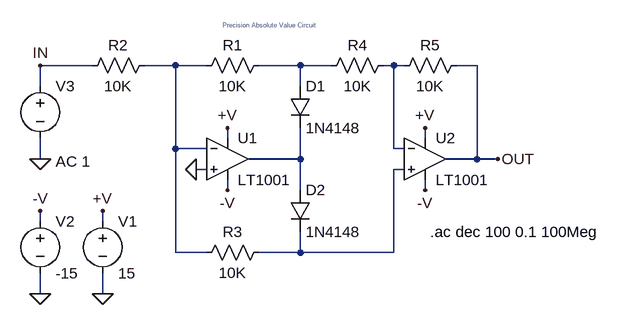
[diagram p0: schematic Fig_3-7_LT1001_AC.asc]
Fig_3-7_LT1001_AC.asc, the LTspice schematic file:
Version 4
SHEET 1 896 680
WIRE -16 96 -96 96
WIRE 112 96 64 96
WIRE 160 96 112 96
WIRE 304 96 240 96
WIRE 352 96 304 96
WIRE 448 96 432 96
WIRE 464 96 448 96
WIRE 576 96 544 96
WIRE -96 128 -96 96
WIRE 304 128 304 96
WIRE 192 208 192 192
WIRE 496 208 496 192
WIRE 112 224 112 96
WIRE 160 224 112 224
WIRE 448 224 448 96
WIRE 464 224 448 224
WIRE -96 240 -96 208
WIRE 304 240 304 192
WIRE 304 240 224 240
WIRE 576 240 576 96
WIRE 576 240 528 240
WIRE 608 240 576 240
WIRE 160 256 144 256
WIRE 464 256 448 256
WIRE 192 288 192 272
WIRE 304 288 304 240
WIRE 496 288 496 272
WIRE -96 336 -96 320
WIRE 0 336 0 320
WIRE 112 384 112 224
WIRE 160 384 112 384
WIRE 304 384 304 352
WIRE 304 384 240 384
WIRE 448 384 448 256
WIRE 448 384 304 384
WIRE -96 448 -96 416
WIRE 0 448 0 416
FLAG 0 448 0
FLAG 192 192 +V
FLAG 0 320 +V
FLAG 192 288 -V
FLAG -96 448 0
FLAG -96 320 -V
FLAG -96 240 0
FLAG 496 192 +V
FLAG 496 288 -V
FLAG 144 256 0
FLAG -96 96 IN
FLAG 608 240 OUT
SYMBOL voltage 0 320 R0
SYMATTR InstName V1
SYMATTR Value 15
SYMBOL opamps\\LT1001 192 176 R0
SYMATTR InstName U1
SYMBOL voltage -96 320 R0
SYMATTR InstName V2
SYMATTR Value -15
SYMBOL res 256 80 R90
WINDOW 0 0 56 VBottom 2
WINDOW 3 32 56 VTop 2
SYMATTR InstName R1
SYMATTR Value 10K
SYMBOL voltage -96 112 R0
WINDOW 123 24 132 Left 2
WINDOW 39 0 0 Left 2
SYMATTR Value2 AC 1
SYMATTR InstName V3
SYMATTR Value ""
SYMBOL opamps\\LT1001 496 176 R0
SYMATTR InstName U2
SYMBOL diode 288 128 R0
SYMATTR InstName D1
SYMATTR Value 1N4148
SYMBOL res 80 80 R90
WINDOW 0 0 56 VBottom 2
WINDOW 3 32 56 VTop 2
SYMATTR InstName R2
SYMATTR Value 10K
SYMBOL res 256 368 R90
WINDOW 0 0 56 VBottom 2
WINDOW 3 32 56 VTop 2
SYMATTR InstName R3
SYMATTR Value 10K
SYMBOL res 448 80 R90
WINDOW 0 0 56 VBottom 2
WINDOW 3 32 56 VTop 2
SYMATTR InstName R4
SYMATTR Value 10K
SYMBOL res 560 80 R90
WINDOW 0 0 56 VBottom 2
WINDOW 3 32 56 VTop 2
SYMATTR InstName R5
SYMATTR Value 10K
SYMBOL diode 288 288 R0
SYMATTR InstName D2
SYMATTR Value 1N4148
TEXT 504 352 Left 2 !.ac dec 100 0.1 100Meg
TEXT 256 40 Bottom 0 ;Precision Absolute Value Circuit

The netlist it stands for:
* Fig_3-7_LT1001_AC.asc
V1 +V 0 15
XU1 0 N001 +V -V N004 LT1001  ; pins In+ In- V+ V- OUT
V2 -V 0 -15
R1 N002 N001 10K
V3 IN 0 AC 1
XU2 N005 N003 +V -V OUT LT1001  ; pins In+ In- V+ V- OUT
D1 N002 N004 1N4148
R2 N001 IN 10K
R3 N005 N001 10K
R4 N003 N002 10K
R5 OUT N003 10K
D2 N004 N005 1N4148
.model D D
.lib standard.dio
.ac dec 100 0.1 100Meg
* Precision Absolute Value Circuit
.lib LTC.lib
.backanno
.end